# Altium project e-paper_driver.PrjPcb
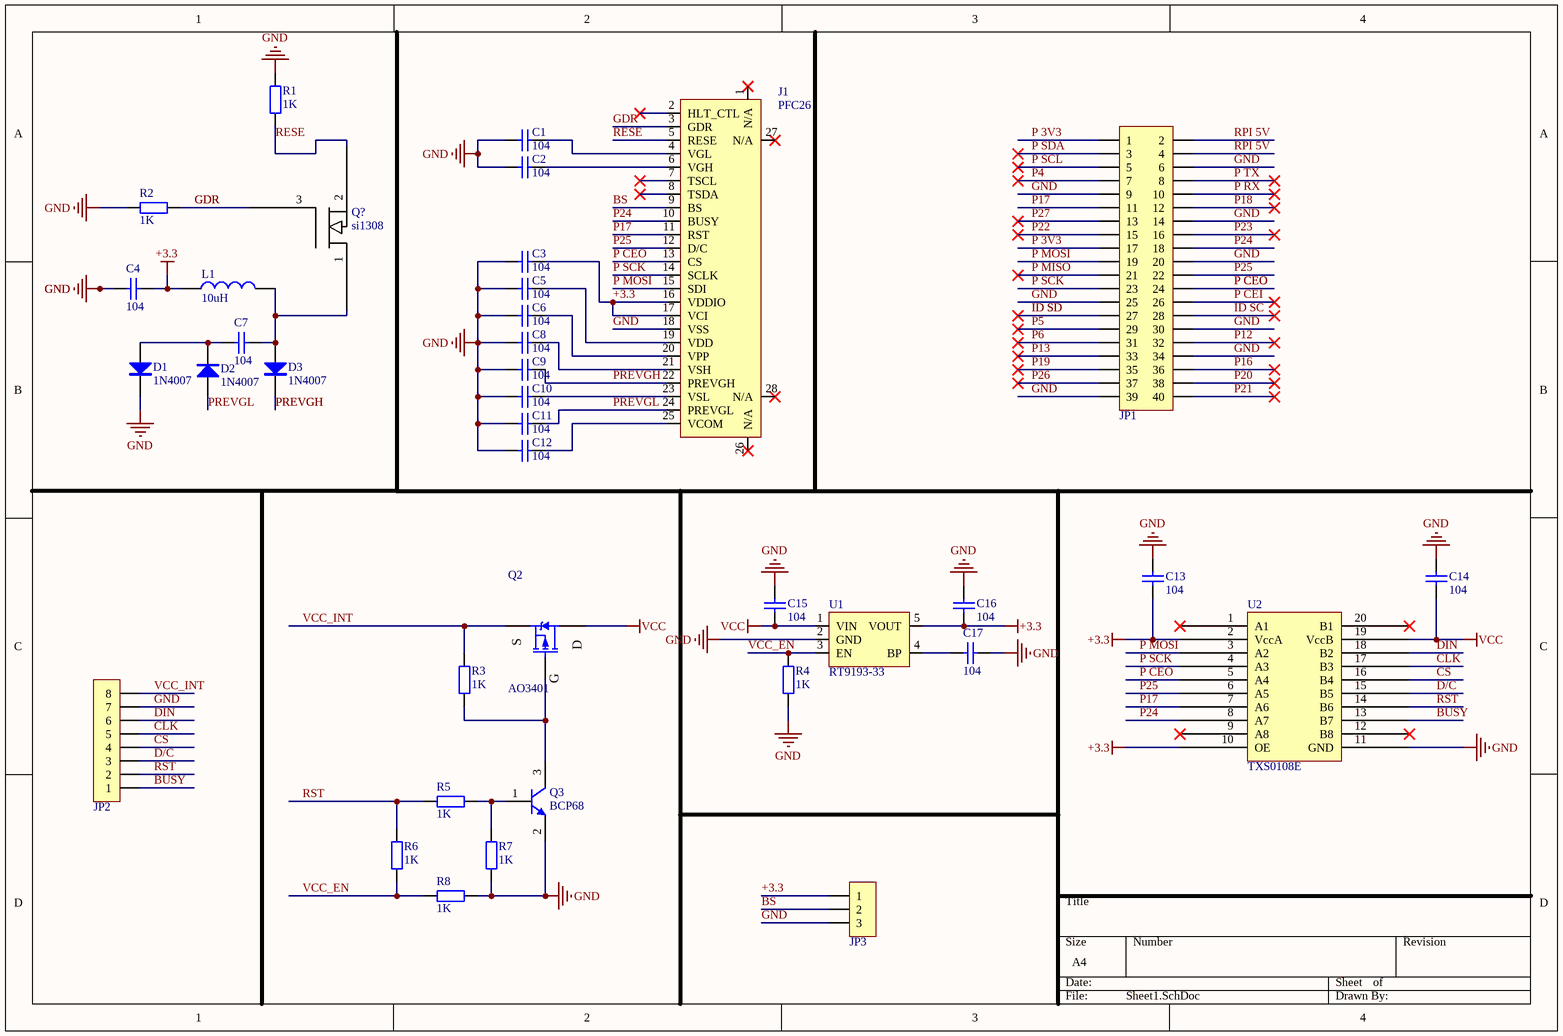
[diagram p0: Sheet1.SchDoc]
1 sheet, 38 parts. Net scope: global (net labels, ports and power ports of the same name join across sheets).
Board file: PCB1.PcbDoc

## Sheet Sheet1.SchDoc: E-paper_Driver
size A4

### Parts
C1  104  [C0805_L]
C2  104  [C0805_L]
C3  104  [C0805_L]
C4  104  [C0805_L]
C5  104  [C0805_L]
C6  104  [C0805_L]
C7  104  [C0805_L]
C8  104  [C0805_L]
C9  104  [C0805_L]
C10  104  [C0805_L]
C11  104  [C0805_L]
C12  104  [C0805_L]
C13  104  [C0805_L]
C14  104  [C0805_L]
C15  104  [C0805_L]
C16  104  [C0805_L]
C17  104  [C0805_L]
D1  1N4007  [SOD-123]
D2  1N4007  [SOD-123]
D3  1N4007  [SOD-123]
J1  PFC26  [PFC26]
JP1  Header 2X11  [HDR2.54-M-LS-2x20P]  (value not drawn)
JP2  HDR-1X8  [XH2.54-LI-8P]  (value not drawn)
JP3  HDR-1X3  [HDR2.54-LI-3P]  (value not drawn)
L1  10uH  [L0805]
Q2  AO3401  [SOT23-3N]
Q3  BCP68  [SOT23-3M]
Q?  si1308  [si1308]
R1  1K  [R0805_L]
R2  1K  [R0805_L]
R3  1K  [R0805_L]
R4  1K  [R0805_L]
R5  1K  [R0805_L]
R6  1K  [R0805_L]
R7  1K  [R0805_L]
R8  1K  [R0805_L]
U1  RT9193-33  [RT9193-33]
U2  TXS0108E  [TXS0108E]

### Nets
+3.3: C3.2 C4.2 C13.1 C16.1 J1.16(VDDIO) J1.17(VCI) JP3.1 L1.1 U1.5(VOUT) U2.2(VccA) U2.10(OE)
GND: C1.1 C2.1 C3.1 C4.1 C5.1 C6.1 C8.1 C9.1 C10.1 C11.1 C12.1 C13.2 C14.2 C15.2 C16.2 C17.2 D1.2(K) J1.18(VSS) JP1.6 JP1.9 JP1.14 JP1.20 JP1.25 JP1.30 JP1.34 JP1.39 JP2.7 JP3.3 Q3.2(E) R1.2 R2.1 R4.1 R7.2 R8.2 U1.2(GND) U2.11(GND)
VCC: C14.1 C15.1 Q2.3(D) U1.1(VIN) U2.19(VccB)
BS: J1.9(BS) JP3.2
BUSY: JP2.1 U2.13(B7)
CLK: JP2.5 U2.17(B3)
CS: JP2.4 U2.16(B4)
D/C: JP2.3 U2.15(B5)
DIN: JP2.6 U2.18(B2)
GDR: J1.3(GDR) Q?.3 R2.2
ID SC: JP1.28
ID SD: JP1.27
P4: JP1.7
P5: JP1.29
P6: JP1.31
P12: JP1.32
P13: JP1.33
P16: JP1.36
P17: J1.11(RST) JP1.11 U2.7(A6)
P18: JP1.12
P19: JP1.35
P20: JP1.38
P21: JP1.40
P22: JP1.15
P23: JP1.16
P24: J1.10(BUSY) JP1.18 U2.8(A7)
P25: J1.12(D/C) JP1.22 U2.6(A5)
P26: JP1.37
P27: JP1.13
P 3V3: JP1.1 JP1.17
P CEI: JP1.26
P CEO: J1.13(CS) JP1.24 U2.5(A4)
P MISO: JP1.21
P MOSI: J1.15(SDI) JP1.19 U2.3(A2)
P RX: JP1.10
P SCK: J1.14(SCLK) JP1.23 U2.4(A3)
P SCL: JP1.5
P SDA: JP1.3
P TX: JP1.8
PREVGH: C9.2 D3.2(K) J1.22(PREVGH)
PREVGL: C11.2 D2.1(A) J1.24(PREVGL)
RESE: J1.5(RESE) Q?.2 R1.1
RPI 5V: JP1.2 JP1.4
RST: JP2.2 R5.1 R6.1 U2.14(B6)
VCC_EN: R4.2 R6.2 R8.1 U1.3(EN)
VCC_INT: JP2.8 Q2.2(S) R3.1
NetC1_2: C1.2 J1.4(VGL)
NetC2_2: C2.2 J1.6(VGH)
NetC5_2: C5.2 J1.19(VDD)
NetC6_2: C6.2 J1.20(VPP)
NetC7_1: C7.1 D1.1(A) D2.2(K)
NetC7_2: C7.2 D3.1(A) L1.2 Q?.1
NetC8_2: C8.2 J1.21(VSH)
NetC10_2: C10.2 J1.23(VSL)
NetC12_2: C12.2 J1.25(VCOM)
NetC17_1: C17.1 U1.4(BP)
NetQ2_1: Q2.1(G) Q3.3(C) R3.2
NetQ3_1: Q3.1(B) R5.2 R7.1

Not connected (* = marked no-connect by the designer): J1 1(N/A)* 2(HLT_CTL)* 7(TSCL)* 8(TSDA)* 26(N/A)* 27(N/A)* 28(N/A)*; U2 1(A1)* 9(A8)* 12(B8)* 20(B1)*

### Library data of the parts
C1-C17 = C: 贴片电容/MLCC电容; BOM名称: 无极性贴片电容; 联系卖家，免费查找封装: 唯一出售店铺网址https://shop463601444.taobao.com
D1-D3 = 1N4007: 整流二极管; 以赠品形式获赠本封装库的买家，还可联系卖家免费指导AD软件使用: 封装库来自淘宝卖家ID：黄晶宝石; BOM名称: 整流二极管
JP1 = Header 20X2: 20*2P接插件; 联系卖家，免费查找封装: 唯一出售店铺网址https://shop463601444.taobao.com; 封装库来自淘宝卖家ID:黄晶宝石: 其他店铺购入均为盗版假冒封装库，请立即申请退款，本店现金奖励20~200元; BOM名称: 20*2P接插件
JP2 = Header 8: 8P接插件; 联系卖家，免费查找封装: 唯一出售店铺网址https://shop463601444.taobao.com; 封装库来自淘宝卖家ID:黄晶宝石: 其他店铺购入均为盗版假冒封装库，请立即申请退款，本店现金奖励20~200元; BOM名称: 8P接插件
JP3 = Header 3: 3P接插件; 联系卖家，免费查找封装: 唯一出售店铺网址https://shop463601444.taobao.com; 封装库来自淘宝卖家ID:黄晶宝石: 其他店铺购入均为盗版假冒封装库，请立即申请退款，本店现金奖励20~200元; BOM名称: 3P接插件
L1 = L: 贴片小功率电感; BOM名称: 小功率贴片电感; 联系卖家，免费查找封装: 唯一出售店铺网址https://shop463601444.taobao.com
Q2 = AO3401: P沟道 30V/4.2A; BOM名称: 场效应管; 8元以下特价购入的买家: 还可以联系卖家远程指导AD软件使用; 参数: P沟道 30V/4.2A
Q3 = BCP68: NPN三极管; 8元以下特价购入的买家: 还可以联系卖家远程指导AD软件使用
R1-R8 = R: 贴片电阻; 联系卖家，免费查找封装: 唯一出售店铺网址https://shop463601444.taobao.com; BOM名称: 贴片电阻